# Altium project MB1184.PrjPCB
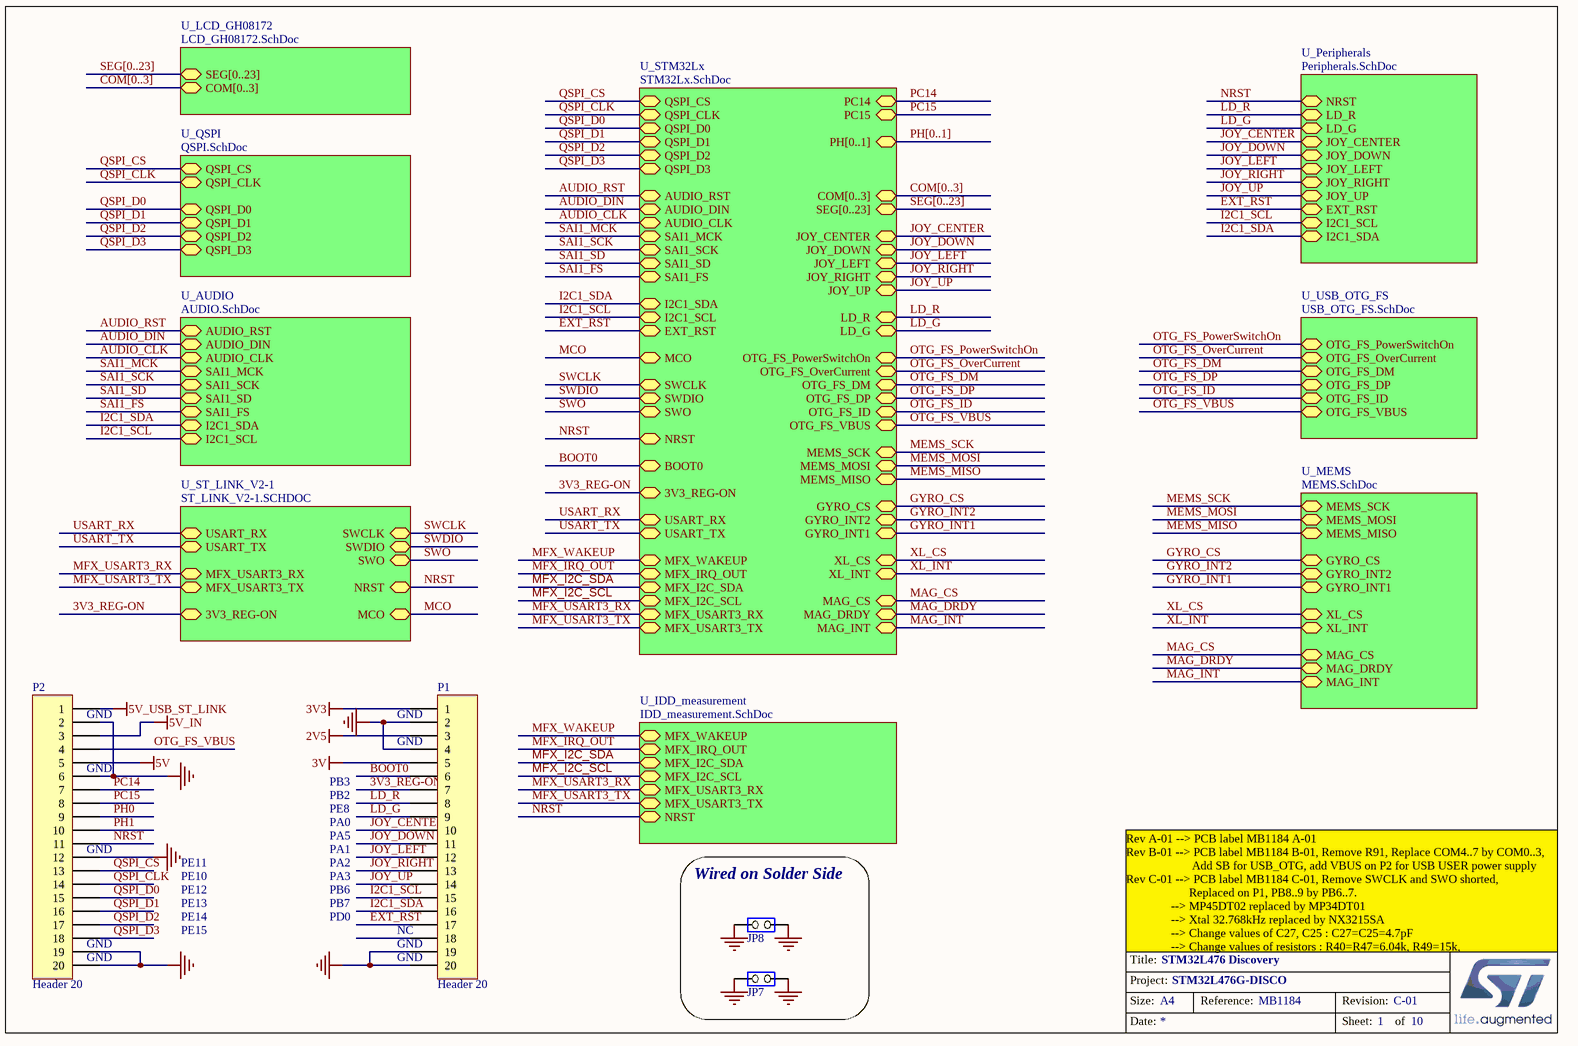
[diagram p0: MB1184.SchDoc]
5 sheets, 147 parts. Net scope: hierarchical (ports join the sheet entries above them; power ports are global).
Sheets:
  MB1184.SchDoc
    U_ST_LINK_V2-1 = ST_LINK_V2-1.SCHDOC
    U_USB_OTG_FS = USB_OTG_FS.SchDoc
    U_Peripherals = Peripherals.SchDoc
    U_QSPI = QSPI.SchDoc

## Sheet MB1184.SchDoc: STM32L476 Discovery
size A4; Date: 01-DEC-2013; Author: A.B; CompanyName: STMicroelectronics; Organization: Microcontrollers Division; Address1: 12, Rue Jules HOROWITZ; Address2: 38019 Grenoble; Address3: FRANCE; DocumentNumber: MB1184; Revision: C-01; SheetNumber: 1; SheetTotal: 10; Project: STM32L476G-DISCO

### Parts
JP7  Jumper 2 pins  [SIP2/2.54]  (value not drawn)
JP8  Jumper 2 pins  [SIP2/2.54]  (value not drawn)
P1  Header 20  [HDR1X20]
P2  Header 20  [HDR1X20]

### Blocks framed on the sheet
Wired on Solder Side: JP7 JP8

### Sub-sheets
U_AUDIO = AUDIO.SchDoc (file not in this document): AUDIO_CLK, AUDIO_DIN, AUDIO_RST, SAI1_FS, SAI1_SD, SAI1_SCK, I2C1_SCL, I2C1_SDA, SAI1_MCK
U_IDD_measurement = IDD_measurement.SchDoc (file not in this document): MFX_WAKEUP, MFX_IRQ_OUT, MFX_I2C_SDA, MFX_I2C_SCL, MFX_USART3_RX, MFX_USART3_TX, NRST
U_LCD_GH08172 = LCD_GH08172.SchDoc (file not in this document): SEG[0..23], COM[0..3]
U_MEMS = MEMS.SchDoc (file not in this document): GYRO_CS, MAG_CS, MAG_INT, XL_INT, MAG_DRDY, MEMS_SCK, MEMS_MISO, MEMS_MOSI, GYRO_INT1, GYRO_INT2, XL_CS
U_Peripherals = Peripherals.SchDoc: NRST, LD_R, LD_G, EXT_RST, JOY_CENTER, JOY_DOWN, JOY_LEFT, JOY_RIGHT, JOY_UP, I2C1_SCL, I2C1_SDA
U_QSPI = QSPI.SchDoc: QSPI_D0, QSPI_D3, QSPI_D2 (bidir), QSPI_D1, QSPI_CLK, QSPI_CS
U_ST_LINK_V2-1 = ST_LINK_V2-1.SCHDOC: SWDIO, SWCLK, MCO, NRST, USART_RX, USART_TX, MFX_USART3_RX, MFX_USART3_TX, SWO, 3V3_REG-ON
U_STM32Lx = STM32Lx.SchDoc (file not in this document): NRST, MCO, LD_R, SWCLK, SWDIO, USART_TX, USART_RX, LD_G, MFX_IRQ_OUT, MFX_WAKEUP, QSPI_D0, QSPI_D3, QSPI_D2 (bidir), QSPI_D1, QSPI_CLK, QSPI_CS, SAI1_FS, SAI1_SD, SAI1_SCK, I2C1_SCL, I2C1_SDA, AUDIO_RST, SAI1_MCK, AUDIO_DIN, AUDIO_CLK, OTG_FS_PowerSwitchOn, OTG_FS_DM, OTG_FS_DP, OTG_FS_ID, OTG_FS_VBUS, OTG_FS_OverCurrent, SEG[0..23], COM[0..3], EXT_RST, PH[0..1], JOY_CENTER, JOY_DOWN, JOY_LEFT, JOY_RIGHT, JOY_UP, MEMS_SCK, MEMS_MISO, MEMS_MOSI, GYRO_CS, GYRO_INT1, GYRO_INT2, XL_CS, XL_INT, MAG_CS, MAG_DRDY, MAG_INT, MFX_USART3_RX, MFX_USART3_TX, MFX_I2C_SDA, MFX_I2C_SCL, BOOT0, SWO, 3V3_REG-ON, PC14, PC15
U_USB_OTG_FS = USB_OTG_FS.SchDoc: OTG_FS_PowerSwitchOn, OTG_FS_OverCurrent, OTG_FS_DM, OTG_FS_DP, OTG_FS_ID, OTG_FS_VBUS

### Nets
2V5: P1.3
3V: P1.5
3V3: P1.1
5V: P2.5
5V_IN: P2.3
5V_USB_ST_LINK: P2.1
GND: JP7.1(COMMON) JP7.2(NO) JP8.1(COMMON) JP8.2(NO) P1.2 P1.4 P1.19 P1.20 P2.2 P2.6 P2.12 P2.19 P2.20
3V3_REG-ON: P1.7 ; sheet U_STM32Lx/3V3_REG-ON, sheet U_ST_LINK_V2-1/3V3_REG-ON
AUDIO_CLK: sheet U_STM32Lx/AUDIO_CLK, sheet U_AUDIO/AUDIO_CLK
AUDIO_DIN: sheet U_STM32Lx/AUDIO_DIN, sheet U_AUDIO/AUDIO_DIN
AUDIO_RST: sheet U_STM32Lx/AUDIO_RST, sheet U_AUDIO/AUDIO_RST
BOOT0: P1.6 ; sheet U_STM32Lx/BOOT0
EXT_RST: P1.17 ; sheet U_STM32Lx/EXT_RST, sheet U_Peripherals/EXT_RST
GYRO_CS: sheet U_STM32Lx/GYRO_CS, sheet U_MEMS/GYRO_CS
GYRO_INT1: sheet U_STM32Lx/GYRO_INT1, sheet U_MEMS/GYRO_INT1
GYRO_INT2: sheet U_STM32Lx/GYRO_INT2, sheet U_MEMS/GYRO_INT2
I2C1_SCL: P1.15 ; sheet U_STM32Lx/I2C1_SCL, sheet U_AUDIO/I2C1_SCL, sheet U_Peripherals/I2C1_SCL
I2C1_SDA: P1.16 ; sheet U_STM32Lx/I2C1_SDA, sheet U_AUDIO/I2C1_SDA, sheet U_Peripherals/I2C1_SDA
JOY_CENTER: P1.10 ; sheet U_STM32Lx/JOY_CENTER, sheet U_Peripherals/JOY_CENTER
JOY_DOWN: P1.11 ; sheet U_STM32Lx/JOY_DOWN, sheet U_Peripherals/JOY_DOWN
JOY_LEFT: P1.12 ; sheet U_STM32Lx/JOY_LEFT, sheet U_Peripherals/JOY_LEFT
JOY_RIGHT: P1.13 ; sheet U_STM32Lx/JOY_RIGHT, sheet U_Peripherals/JOY_RIGHT
JOY_UP: P1.14 ; sheet U_STM32Lx/JOY_UP, sheet U_Peripherals/JOY_UP
LD_G: P1.9 ; sheet U_STM32Lx/LD_G, sheet U_Peripherals/LD_G
LD_R: P1.8 ; sheet U_STM32Lx/LD_R, sheet U_Peripherals/LD_R
MAG_CS: sheet U_STM32Lx/MAG_CS, sheet U_MEMS/MAG_CS
MAG_DRDY: sheet U_STM32Lx/MAG_DRDY, sheet U_MEMS/MAG_DRDY
MAG_INT: sheet U_STM32Lx/MAG_INT, sheet U_MEMS/MAG_INT
MCO: sheet U_STM32Lx/MCO, sheet U_ST_LINK_V2-1/MCO
MEMS_MISO: sheet U_STM32Lx/MEMS_MISO, sheet U_MEMS/MEMS_MISO
MEMS_MOSI: sheet U_STM32Lx/MEMS_MOSI, sheet U_MEMS/MEMS_MOSI
MEMS_SCK: sheet U_STM32Lx/MEMS_SCK, sheet U_MEMS/MEMS_SCK
MFX_I2C_SCL: sheet U_STM32Lx/MFX_I2C_SCL, sheet U_IDD_measurement/MFX_I2C_SCL
MFX_I2C_SDA: sheet U_STM32Lx/MFX_I2C_SDA, sheet U_IDD_measurement/MFX_I2C_SDA
MFX_IRQ_OUT: sheet U_STM32Lx/MFX_IRQ_OUT, sheet U_IDD_measurement/MFX_IRQ_OUT
MFX_USART3_RX: sheet U_STM32Lx/MFX_USART3_RX, sheet U_ST_LINK_V2-1/MFX_USART3_RX, sheet U_IDD_measurement/MFX_USART3_RX
MFX_USART3_TX: sheet U_STM32Lx/MFX_USART3_TX, sheet U_ST_LINK_V2-1/MFX_USART3_TX, sheet U_IDD_measurement/MFX_USART3_TX
MFX_WAKEUP: sheet U_STM32Lx/MFX_WAKEUP, sheet U_IDD_measurement/MFX_WAKEUP
NRST: P2.11 ; sheet U_STM32Lx/NRST, sheet U_ST_LINK_V2-1/NRST, sheet U_IDD_measurement/NRST, sheet U_Peripherals/NRST
OTG_FS_DM: sheet U_STM32Lx/OTG_FS_DM, sheet U_USB_OTG_FS/OTG_FS_DM
OTG_FS_DP: sheet U_STM32Lx/OTG_FS_DP, sheet U_USB_OTG_FS/OTG_FS_DP
OTG_FS_ID: sheet U_STM32Lx/OTG_FS_ID, sheet U_USB_OTG_FS/OTG_FS_ID
OTG_FS_OverCurrent: sheet U_STM32Lx/OTG_FS_OverCurrent, sheet U_USB_OTG_FS/OTG_FS_OverCurrent
OTG_FS_PowerSwitchOn: sheet U_STM32Lx/OTG_FS_PowerSwitchOn, sheet U_USB_OTG_FS/OTG_FS_PowerSwitchOn
OTG_FS_VBUS: P2.4 ; sheet U_STM32Lx/OTG_FS_VBUS, sheet U_USB_OTG_FS/OTG_FS_VBUS
PC14: P2.7 ; sheet U_STM32Lx/PC14
PC15: P2.8 ; sheet U_STM32Lx/PC15
PH0: P2.9
PH1: P2.10
QSPI_CLK: P2.14 ; sheet U_STM32Lx/QSPI_CLK, sheet U_QSPI/QSPI_CLK
QSPI_CS: P2.13 ; sheet U_STM32Lx/QSPI_CS, sheet U_QSPI/QSPI_CS
QSPI_D0: P2.15 ; sheet U_STM32Lx/QSPI_D0, sheet U_QSPI/QSPI_D0
QSPI_D1: P2.16 ; sheet U_STM32Lx/QSPI_D1, sheet U_QSPI/QSPI_D1
QSPI_D2: P2.17 ; sheet U_STM32Lx/QSPI_D2, sheet U_QSPI/QSPI_D2
QSPI_D3: P2.18 ; sheet U_STM32Lx/QSPI_D3, sheet U_QSPI/QSPI_D3
SAI1_FS: sheet U_STM32Lx/SAI1_FS, sheet U_AUDIO/SAI1_FS
SAI1_MCK: sheet U_STM32Lx/SAI1_MCK, sheet U_AUDIO/SAI1_MCK
SAI1_SCK: sheet U_STM32Lx/SAI1_SCK, sheet U_AUDIO/SAI1_SCK
SAI1_SD: sheet U_STM32Lx/SAI1_SD, sheet U_AUDIO/SAI1_SD
SWCLK: sheet U_STM32Lx/SWCLK, sheet U_ST_LINK_V2-1/SWCLK
SWDIO: sheet U_STM32Lx/SWDIO, sheet U_ST_LINK_V2-1/SWDIO
SWO: sheet U_STM32Lx/SWO, sheet U_ST_LINK_V2-1/SWO
USART_RX: sheet U_STM32Lx/USART_RX, sheet U_ST_LINK_V2-1/USART_RX
USART_TX: sheet U_STM32Lx/USART_TX, sheet U_ST_LINK_V2-1/USART_TX
XL_CS: sheet U_STM32Lx/XL_CS, sheet U_MEMS/XL_CS
XL_INT: sheet U_STM32Lx/XL_INT, sheet U_MEMS/XL_INT

Not connected (* = marked no-connect by the designer): P1 18

### Buses and harness runs
bus COM[0..3] = sheet U_LCD_GH08172/COM[0..3]
bus COM[0..3] = sheet U_STM32Lx/COM[0..3]
bus PH[0..1] = sheet U_STM32Lx/PH[0..1]
bus SEG[0..23] = sheet U_LCD_GH08172/SEG[0..23]
bus SEG[0..23] = sheet U_STM32Lx/SEG[0..23]

### Notes on the sheet
- (near P2) GND
- (near P1) GND
- PB3
- PB2
- PE8
- PA0
- PA5
- PA1
- PE11
- PE10
- PE12
- PE13
- PE14
- PA2
- PA3
- PB6
- PB7
- PD0
- PE15
- (near P1) NC
- Rev A-01 --> PCB label MB1184 A-01
  Rev B-01 --> PCB label MB1184 B-01, Remove R91, Replace COM4..7 by COM0..3,
  Add SB for USB_OTG, add VBUS on P2 for USB USER power supply
  Rev C-01 --> PCB label MB1184 C-01, Remove SWCLK and SWO shorted,
  Replaced on P1, PB8..9 by PB6..7.
  --> MP45DT02 replaced by MP34DT01
  --> Xtal 32.768kHz replaced by NX3215SA
  --> Change values of C27, C25 : C27=C25=4.7pF
  --> Change values of resistors : R40=R47=6.04k, R49=15k, R48=R42=R50=300k
- Title:
- Project:
- Size:
- Date:
- A4
- Reference:
- Sheet:
- Revision:
- of

### Library data of the parts
JP7 JP8 = Jumper2: ECCN_US/EU: n/a
P1 P2 = Header 20: Header, 20-Pin; LatestRevisionDate: 17-Jul-2002; LatestRevisionNote: Re-released for DXP Platform.; Publisher: Altium Limited

## Sheet ST_LINK_V2-1.SCHDOC: ST-LINK/V2-1 with support of SWD only
size A4; Date: 01-DEC-2013; Author: A.B; CompanyName: STMicroelectronics; Organization: Microcontrollers Division; Address1: 12, Rue Jules HOROWITZ; Address2: 38019 Grenoble; Address3: FRANCE; DocumentNumber: MB1184; Revision: C-01; SheetNumber: 2; SheetTotal: 10; Project: STM32L476G-DISCO
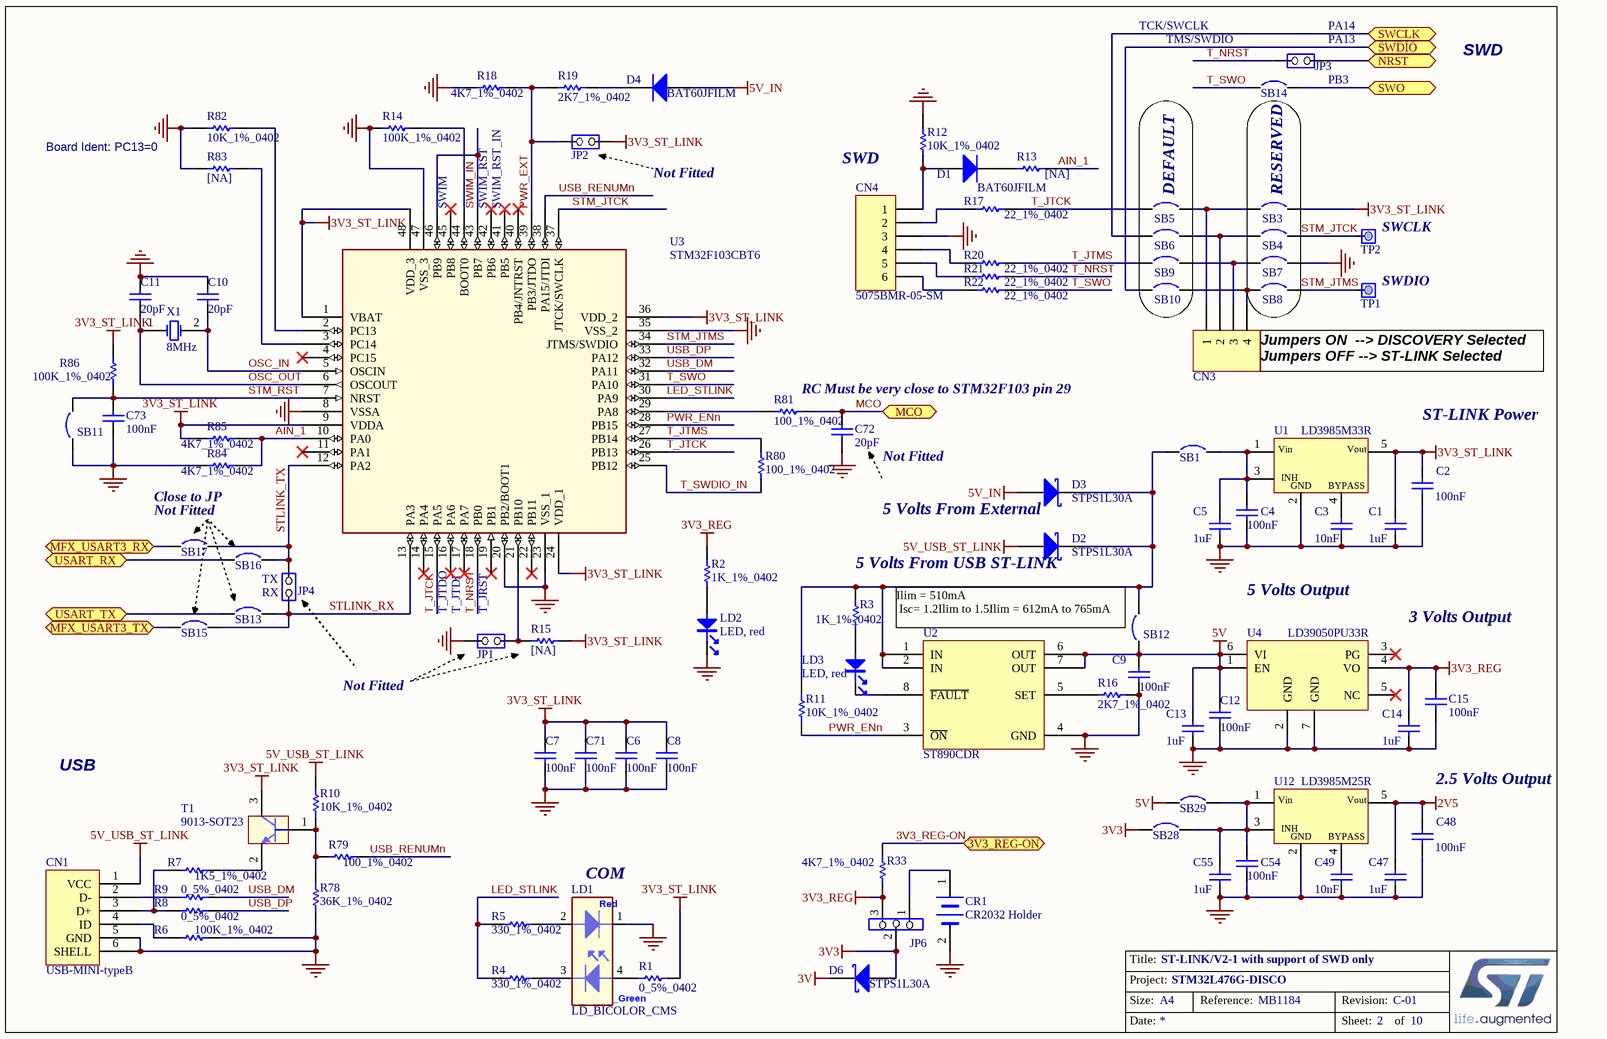
[diagram p1: ST_LINK_V2-1.SCHDOC]

### Parts
C1  1uF  [0603C]
C2  100nF  [0402C]
C3  10nF  [0603C]
C4  100nF  [0402C]
C5  1uF  [0603C]
C6  100nF  [0402C]
C7  100nF  [0402C]
C8  100nF  [0402C]
C9  100nF  [0402C]
C10  20pF  [0402C]
C11  20pF  [0402C]
C12  100nF  [0402C]
C13  1uF  [0603C]
C14  1uF  [0603C]
C15  100nF  [0402C]
C47  1uF  [0603C]
C48  100nF  [0402C]
C49  10nF  [0603C]
C54  100nF  [0402C]
C55  1uF  [0603C]
C71  100nF  [0402C]
C72  20pF  [0402C]
C73  100nF  [0402C]
CN1  USB-MINI-typeB  [USB-MINI-B-SMD]
CN3  Header 4  [Header 4]  (value not drawn)
CN4  5075BMR-05-SM  [HDR1X6]
CR1  CR2032 Holder  [CR2032/SMT]
D1  BAT60JFILM  [SOD323/A]
D2  STPS1L30A  [SMA]
D3  STPS1L30A  [SMA]
D4  BAT60JFILM  [SOD323/A]
D6  STPS1L30A  [SMA]
JP1  Jumper 2 pins  [SIP2/2.54]  (value not drawn)
JP2  Jumper 2 pins  [SIP2/2.54]  (value not drawn)
JP3  Jumper 2 pins  [SIP2/2.54]  (value not drawn)
JP4  Jumper 2 pins  [SIP2/2.54]  (value not drawn)
JP6  Jumper 3 pins  [SIP3]  (value not drawn)
LD1  LD_BICOLOR_CMS  [HSMF-A201]
LD2  LED, red  [0603D]
LD3  LED, red  [0603D]
R1  0_5%_0402  [0402R]
R2  1K_1%_0402  [0402R]
R3  1K_1%_0402  [0402R]
R4  330_1%_0402  [0402R]
R5  330_1%_0402  [0402R]
R6  100K_1%_0402  [0402R]
R7  1K5_1%_0402  [0402R]
R8  0_5%_0402  [0402R]
R9  0_5%_0402  [0402R]
R10  10K_1%_0402  [0402R]
R11  10K_1%_0402  [0402R]
R12  10K_1%_0402  [0402R]
R13  [NA]  [0402R]
R14  100K_1%_0402  [0402R]
R15  [NA]  [0402R]
R16  2K7_1%_0402  [0402R]
R17  22_1%_0402  [0402R]
R18  4K7_1%_0402  [0402R]
R19  2K7_1%_0402  [0402R]
R20  22_1%_0402  [0402R]
R21  22_1%_0402  [0402R]
R22  22_1%_0402  [0402R]
R33  4K7_1%_0402  [0402R]
R78  36K_1%_0402  [0402R]
R79  100_1%_0402  [0402R]
R80  100_1%_0402  [0402R]
R81  100_1%_0402  [0402R]
R82  10K_1%_0402  [0402R]
R83  [NA]  [0402R]
R84  4K7_1%_0402  [0402R]
R85  4K7_1%_0402  [0402R]
R86  100K_1%_0402  [0402R]
SB1  Circuit Breaker  [JP2_SMD]  (value not drawn)
SB3  Circuit Breaker  [JP2_SMD]  (value not drawn)
SB4  Circuit Breaker  [JP2_SMD]  (value not drawn)
SB5  Circuit Breaker  [JP2_SMD]  (value not drawn)
SB6  Circuit Breaker  [JP2_SMD]  (value not drawn)
SB7  Circuit Breaker  [JP2_SMD]  (value not drawn)
SB8  Circuit Breaker  [JP2_SMD]  (value not drawn)
SB9  Circuit Breaker  [JP2_SMD]  (value not drawn)
SB10  Circuit Breaker  [JP2_SMD]  (value not drawn)
SB11  Circuit Breaker  [JP2_SMD]  (value not drawn)
SB12  Circuit Breaker  [JP2_SMD]  (value not drawn)
SB13  Circuit Breaker  [JP2_SMD]  (value not drawn)
SB14  Circuit Breaker  [JP2_SMD]  (value not drawn)
SB15  Circuit Breaker  [JP2_SMD]  (value not drawn)
SB16  Circuit Breaker  [JP2_SMD]  (value not drawn)
SB17  Circuit Breaker  [JP2_SMD]  (value not drawn)
SB28  Circuit Breaker  [JP2_SMD]  (value not drawn)
SB29  Circuit Breaker  [JP2_SMD]  (value not drawn)
T1  9013-SOT23  [SOT23]
TP1  Test point 1 pin with hole  [SIP1/2.54]  (value not drawn)
TP2  Test point 1 pin with hole  [SIP1/2.54]  (value not drawn)
U1  LD3985M33R  [SOT-23-5L]
U2  ST890CDR  [SO-8]
U3  STM32F103CBT6  [QFP48 7x7]
U4  LD39050PU33R  [DFN6_3x3]
U12  LD3985M25R  [SOT-23-5L]
X1  8MHz  [XTAL1]

### Blocks framed on the sheet
DEFAULT: SB5 SB6 SB9 SB10
RESERVED: SB3 SB4 SB7 SB8

### Ports
3V3_REG-ON, MCO, MFX_USART3_RX, MFX_USART3_TX, NRST, SWCLK, SWDIO, SWO, USART_RX, USART_TX

### Nets
2V5: C47.1 C48.2 U12.5(Vout)
3V: D6.2(K)
3V3: D6.1(A) JP6.2 SB28.1
3V3_REG: C14.2 C15.2 JP6.3 R2.2 R33.1 U4.4(VO)
3V3_ST_LINK: C1.1 C2.2 C6.1 C7.2 C8.2 C71.2 JP2.2(NO) R1.2 R15.2 R85.1 R86.2 SB3.2 T1.3(C) U1.5(Vout) U3.1(VBAT) U3.9(VDDA) U3.24(VDD_1) U3.36(VDD_2) U3.48(VDD_3)
5V: C9.2 C12.2 C13.2 SB12.1 SB29.1 U2.6(OUT) U2.7(OUT) U4.1(EN) U4.6(VI)
5V_IN: D3.1(A) D4.1(A)
5V_USB_ST_LINK: CN1.1(VCC) D2.1(A) R10.2
GND: C1.2 C2.1 C3.1 C4.1 C5.1 C6.2 C7.1 C8.1 C9.1 C10.1 C11.1 C12.1 C13.1 C14.1 C15.1 C47.2 C48.1 C49.1 C54.1 C55.1 C71.1 C72.2 C73.1 CN1.5(GND) CN1.6(SHELL) CN4.3 CR1.2(-) JP1.1(COMMON) LD1.1 LD2.2 R6.2 R12.2 R14.1 R16.2 R18.1 R78.1 R82.1 R83.1 R84.1 SB7.2 SB11.1 U1.2(GND) U2.4(GND) U3.8(VSSA) U3.20(PB2/BOOT1) U3.23(VSS_1) U3.35(VSS_2) U3.47(VSS_3) U4.2(GND) U4.7(GND) U12.2(GND)
3V3_REG-ON: R33.2 ; port 3V3_REG-ON
AIN_1: R13.2 R84.2 R85.2 U3.10(PA0)
LED_STLINK: R4.1 R5.1 U3.30(PA9)
MCO: C72.1 R81.2 ; port MCO
MFX_USART3_RX: SB17.1 ; port MFX_USART3_RX
MFX_USART3_TX: SB15.1 ; port MFX_USART3_TX
NRST: JP3.2(NO) ; port NRST
OSC_IN: C10.2 U3.5(OSCIN) X1.2(OSC2)
OSC_OUT: C11.2 U3.6(OSCOUT) X1.1(OSC1)
PWR_ENn: R11.1 U2.3(~{ON}) U3.28(PB15)
PWR_EXT: JP2.1(COMMON) R18.2 R19.1 U3.39(PB3/JTDO)
STLINK_RX: JP4.1(COMMON) SB13.2 SB15.2 U3.13(PA3)
STLINK_TX: JP4.2(NO) SB16.2 SB17.2 U3.12(PA2)
STM_JTCK: SB4.2 TP2.1(COMMON) U3.37(JTCK/SWCLK)
STM_JTMS: SB8.2 TP1.1(COMMON) U3.34(JTMS/SWDIO)
STM_RST: C73.2 R86.1 SB11.2 U3.7(NRST)
SWCLK: SB6.1 ; port SWCLK
SWDIO: SB10.1 ; port SWDIO
SWIM_IN: U3.43(PB7) U3.46(PB9)
SWO: SB14.2 ; port SWO
T_JTCK: R17.2 SB5.1 U3.15(PA5) U3.26(PB13)
T_JTMS: R20.2 R80.2 SB9.1 U3.27(PB14)
T_NRST: JP3.1(COMMON) R21.2 U3.18(PB0)
T_SWDIO_IN: R80.1 U3.25(PB12)
T_SWO: R22.2 SB14.1 U3.31(PA10)
USART_RX: SB16.1 ; port USART_RX
USART_TX: SB13.1 ; port USART_TX
USB_DM: R9.2 U3.32(PA11)
USB_DP: R8.2 U3.33(PA12)
USB_RENUMn: R79.2 U3.38(PA15/JTDI)
NetC3_2: C3.2 U1.4(BYPASS)
NetC4_2: C4.2 C5.2 SB1.2 U1.1(Vin) U1.3(CE)
NetC49_2: C49.2 U12.4(BYPASS)
NetC54_2: C54.2 C55.2 SB28.2 SB29.2 U12.1(Vin) U12.3(CE)
NetCN1_2: CN1.2(D-) R9.1
NetCN1_3: CN1.3(D+) R7.1 R8.1
NetCN1_4: CN1.4(ID) R6.1
NetCN3_1: CN3.1 SB3.1 SB5.2
NetCN3_2: CN3.2 SB4.1 SB6.2
NetCN3_3: CN3.3 SB7.1 SB9.2
NetCN3_4: CN3.4 SB8.1 SB10.2
NetCN4_1: CN4.1 D1.1(A) R12.1
NetCN4_2: CN4.2 R17.1
NetCN4_4: CN4.4 R20.1
NetCN4_5: CN4.5 R21.1
NetCN4_6: CN4.6 R22.1
NetCR1_1: CR1.1(+) JP6.1
NetD1_2: D1.2(K) R13.1
NetD2_2: D2.2(K) D3.2(K) R3.2 R11.2 SB1.1 SB12.2 U2.1(IN) U2.2(IN)
NetD4_2: D4.2(K) R19.2
NetJP1_2: JP1.2(NO) R15.1 U3.21(PB10)
NetLD1_2: LD1.2 R5.2
NetLD1_3: LD1.3 R4.2
NetLD1_4: LD1.4 R1.1
NetLD2_1: LD2.1 R2.1
NetLD3_1: LD3.1 R3.1
NetLD3_2: LD3.2 U2.8(~{FAULT})
NetR7_2: R7.2 T1.2(E)
NetR10_1: R10.1 R78.2 R79.1 T1.1(B)
NetR14_2: R14.2 U3.44(BOOT0)
NetR16_1: R16.1 U2.5(SET)
NetR81_1: R81.1 U3.29(PA8)
NetR82_2: R82.2 U3.2(PC13)
NetR83_2: R83.2 U3.3(PC14)

Not connected (* = marked no-connect by the designer): U3 4(PC15)* 11(PA1)* 14(PA4)* 16(PA6)* 17(PA7)* 19(PB1)* 22(PB11)* 40(PB4/JNTRST)* 41(PB5)* 42(PB6)* 45(PB8)*; U4 3(PG)* 5(NC)*

### Notes on the sheet
- TCK/SWCLK
- TMS/SWDIO
- (near JP3) PA14
- (near JP3) PA13
- PB3
- SWD
- Board Ident: PC13=0
- Not Fitted
- SWIM
- (near U3) SWIM_RST
- SWIM_RST_IN
- (near TP2) SWCLK
- (near TP1) SWDIO
- (near CN3) Jumpers ON  --> DISCOVERY Selected
  Jumpers OFF --> ST-LINK Selected
- (near R81) RC Must be very close to STM32F103 pin 29
- ST-LINK Power
- Close to JP
- (near C72) Not Fitted
- (near D3) 5 Volts From External
- TX
- (near D2) 5 Volts From USB ST-LINK
- RX
- T_JTDO
- T_JTDI
- T_JRST
- (near SB12) Ilim = 510mA
  Isc= 1.2Ilim to 1.5Ilim = 612mA to 765mA
- 5 Volts Output
- 3 Volts Output
- USB
- 2.5 Volts Output
- (near LD1) COM
- Title:
- Project:
- Size:
- Date:
- A4
- Reference:
- Sheet:
- Revision:
- of
- (in symbol LD3985M25R) INH
- (in symbol LD3985M33R) INH
- (in symbol LD_BICOLOR_CMS) Red; _Green

### Library data of the parts
C1 C5 C13 C14 C47 C55 = Cap_1uF_X5R_10%_0603: Capacitor,1uF,16V,X5R,10%,0603,YAGEO; Manuf_Part_1: CC0603KRX5R7BB105; Revision: July-2002: Re-released for DXP Platform.; Value: 1uF; Order: CC0603KRX5R7BB105; Manuf_1: YAGEO
C2 C4 C6-C9 C12 C15 C48 C54 C71 C73 = Cap_100nF_X7R_10%_0402: Capacitor,100nF,16V,X7R,10%,0402,YAGEO; Manuf_Part_1: CC0402KRX7R7BB104; Revision: July-2002: Re-released for DXP Platform.; Value: 100nF; Order: CC0402KRX7R7BB104; Manuf_1: YAGEO
C3 C49 = Cap_10nF_X7R_10%_0603: Capacitor,10nF,50V,X7R,10%,0603,YAGEO; Manuf_Part_1: CC0603KRX7R9BB103; Revision: July-2002: Re-released for DXP Platform.; Value: 10nF; Order: CC0603KRX7R9BB103; Manuf_1: YAGEO
C10 C11 = Cap_20pF_NPO_5%_0402: Capacitor,20pF,50V,NPO,5%,0402,YAGEO; Order: CC0402JRNPO9BN200; Revision: July-2002: Re-released for DXP Platform.; Value: 20pF; Manuf_1: YAGEO; Manuf_Part_1: CC0402JRNPO9BN200
C72 = Cap_20pF_NPO_5%_0402: Capacitor,20pF,50V,NPO,5%,0402,YAGEO; Order: CC0402JRNPO9BN200; Fitted: NO; Revision: July-2002: Re-released for DXP Platform.; Value: 20pF; Manuf_1: YAGEO; Manuf_Part_1: CC0402JRNPO9BN200
CN1 = USB-MINI-typeB connector: Manuf_Part_1: 5075BMR-05-SM; Manuf_Part_2: 218205M1110T; Manuf_2: lyconn; Order: 5075BMR-05-SM; ECCN_US/EU: n/a
CN3 = Header 4: Header, 4-Pin; Revision: 17-Jul-2002: Re-released for DXP Platform.; Publisher: Altium Limited; ECCN_US/EU: n/a
CN4 = Header 6: Header, 6-Pin; LatestRevisionDate: 17-Jul-2002; LatestRevisionNote: Re-released for DXP Platform.; Publisher: Altium Limited; ECCN_US/EU: n/a
CR1 = BATT_2032: CR2032 socket, S8421-45R; Manuf_2: Lotes; Manuf_Part_2: KB7410AP2L; Manuf_1: HARWIN; Order: 952-1737-2-ND; ECCN_US/EU: EAR99/NEC; Distrib_2: http://www.bestbattery.co.kr/lotes/lotes.htm; Manuf_Part_1: S8421-45R; Distrib: DIGIKEY
D1 D4 = BAT60JFILM: Manuf_1: STM; Provided: ST; ECCN_US/EU: EAR99/NEC; Ref St: 9151097; Revision: July-2002: Re-released for DXP Platform.; Order: BAT60JFILM; Manuf_Part_1: BAT60JFILM; Distrib: ST
D2 D3 D6 = STPS1L30A: Low Drop power Schottky rectifier; Manuf_1: STM; Provided: ST; Ref St: xxxxxxxx; ECCN_US/EU: EAR99/NEC; Manuf_Part_1: STPS1L30A; Order: STPS1L30A; Distrib: ST
JP1 JP2 JP4 = Jumper2: Fitted: NO; ECCN_US/EU: n/a
JP3 = Jumper2: ECCN_US/EU: n/a
JP6 = Jumper3: ECCN_US/EU: n/a
LD1 = LD_BICOLOR_CMS: Bicolor Led; Manuf_Part_1: HSMF-A201-A00J1; Manuf_1: Avago Technologies; Manuf_2: everluck; Manuf_Part_2: LE-RGW35280; Ref St: xxxxxx; ECCN_US/EU: EAR99/NEC; Distrib: RADIOSPARES
LD2 LD3 = LED_red: LED, red, 0603; Manuf_1: everlight; Manuf_Part_1: 19-213-R6C-AP1Q2B/3T; ECCN_US/EU: EAR99/NEC; Order: 19-213-R6C-AP1Q2B/3T
R1 R8 R9 = Res_0_5%_0402: Resistor,0,0402,5%,YAGEO; Manuf_Part_1: RC0402JR-070RL; Value: 0; Order: 2363467; ECCN_US/EU: n/a; Manuf_1: YAGEO; Distrib: FARNELL
R2 R3 = Res_1K_1%_0402: Resistor,1K,0402,1%,YAGEO; Manuf_Part_1: RC0402FR-071KL; Value: 1K; Manuf_1: YAGEO; Order: RC0402FR-071KL; ECCN_US/EU: n/a
R4 R5 = Res_330_1%_0402: Resistor,330,0402,1%,YAGEO; Manuf_Part_1: RC0402FR-07330RL; Value: 330; ECCN_US/EU: n/a; Manuf_1: YAGEO; Distrib: DIGIKEY; Order: RC0402FR-07330RL
R6 R14 R86 = Res_100K_1%_0402: Resistor,100K,0402,1%,YAGEO; Manuf_Part_1: RT0402FRE07100KL; Value: 100K; Manuf_1: YAGEO; Order: RT0402FRE07100KL; ECCN_US/EU: n/a
R7 = Res_1K5_1%_0402: Resistor,1K5,0402,1%,YAGEO; Manuf_Part_1: RC0402FR-071K5L; Value: 1K5; Manuf_1: YAGEO; Order: RC0402FR-071K5L; ECCN_US/EU: n/a; Distrib: FARNELL
R10-R12 R82 = Res_10K_1%_0402: Resistor,10K,0402,1%,YAGEO; Manuf_Part_1: RC0402FR-0710KL; Value: 10K; Manuf_1: YAGEO; Order: RC0402FR-0710KL; ECCN_US/EU: n/a
R13 R15 R83 = Res_NA_0402: Resistor,[NA],0402; Fitted: NO; Value: [NA]; ECCN_US/EU: n/a
R16 R19 = Res_2K7_1%_0402: Resistor,2K7,0402,1%,YAGEO; Manuf_Part_1: RC0402FR-072K7L; Value: 2K7; Manuf_1: YAGEO; Order: RC0402FR-072K7L; ECCN_US/EU: n/a; Distrib: FARNELL
R17 R20-R22 = Res_22_1%_0402: Resistor,22,0402,1%,YAGEO; Manuf_Part_1: RC0402FR-0722RL; Value: 22; Manuf_1: YAGEO; Order: RC0402FR-0722RL; ECCN_US/EU: n/a; Distrib: FARNELL
R18 R33 R84 R85 = Res_4K7_1%_0402: Resistor,4K7,0402,1%,YAGEO; Manuf_Part_1: RT0402FRE074K7L; Value: 4K7; Manuf_1: YAGEO; Order: RT0402FRE074K7L; ECCN_US/EU: n/a
R78 = Res_36K_1%_0402: Resistor,36K,0402,1%,YAGEO; Manuf_Part_1: RC0402FR-0736KL; Value: 36K; Manuf_1: YAGEO; Order: RC0402FR-0736KL; ECCN_US/EU: n/a; Distrib: FARNELL
R79-R81 = Res_100_1%_0402: Resistor,100,0402,1%,YAGEO; Manuf_Part_1: RC0402FR-07100RL; Value: 100; Order: 9239111; Manuf_1: YAGEO; ECCN_US/EU: n/a; Distrib: FARNELL
SB1 SB5 SB6 SB9 SB10 SB13 SB16 SB28 = Circuit Breaker: Solder: YES; Revision: July-2002: Re-released for DXP Platform.
SB3 SB4 SB7 SB8 SB11 SB12 SB14 SB15 SB17 SB29 = Circuit Breaker: Solder: NO; Revision: July-2002: Re-released for DXP Platform.
T1 = 9013-SOT23: NPN Bipolar Transistor; Manuf_1: NXP; Manuf_Part_1: BSR14; Order: 1081310; ECCN_US/EU: EAR99/NEC; Revision: July-2002: Re-released for DXP Platform.; Distrib: FARNELL
TP1 TP2 = TP1: Test Point; Fitted: NO; ECCN_US/EU: n/a
U1 = LD3985M33R: Ultra low drop-low noise BiCMOS voltage, regulators low ESR capacitors compatible; Manuf_1: STM; Provided: ST; Ref St: 9176161; ECCN_US/EU: EAR99/NEC; Manuf_Part_1: LD3985M33R; Distrib: ST; Order: LD3985M33R
U2 = ST890CDR: 1.2 A current limited high-side power switch with thermal shutdown; Manuf_1: STM; ECCN_US/EU: EAR99/NEC; Provided: ST; Manuf_Part_1: ST890CDR; Distrib: ST
U3 = STM32F103CBT6: Medium-density performance line ARM-based 32-bit MCU with 128KB Flash; Manuf_1: STM; Ref St: xxxxxxxx; Provided: ST; ECCN_US/EU: 3A991A2/NEC; Footprint: QFP48 7X7; Manuf_Part_1: STM32F103CBT6; Order: STM32F103CBT6; Distrib: ST
U4 = LD39050P: Ultra low drop-low , 500 mA low quiescent current; Manuf_1: STM; Provided: ST; ECCN_US/EU: EAR99/NEC; Ref St: xxxxxxxx; Distrib: ST; Manuf_Part_1: LD39050PU33R; Order: LD39050PU33R
U12 = LD3985M25R: Ultra low drop-low noise BiCMOS voltage, regulators low ESR capacitors compatible; Manuf_1: STM; Provided: ST; Ref St: 9176007; ECCN_US/EU: EAR99/NEC; Manuf_Part_1: LD3985M25R; Order: LD3985M25R; Distrib: ST
X1 = XTAL_8MHZ_20PPM: Crystal Oscillator,8Mhz,20PF,20PPM,-10-70 degree,DIP,HC-49S; Manuf_Part_1: HC-49S-C20QSA-8.000MHZ; ECCN_US/EU: EAR99/NEC; Order: HC-49S-C20QSA-8.000MHZ

## Sheet USB_OTG_FS.SchDoc: OTG USB FS
size A4; Date: 01-DEC-2013; Author: A.B; CompanyName: STMicroelectronics; Organization: Microcontrollers Division; Address1: 12, Rue Jules HOROWITZ; Address2: 38019 Grenoble; Address3: FRANCE; DocumentNumber: MB1184; Revision: C-01; SheetNumber: 7; SheetTotal: 10; Project: STM32L476G-DISCO
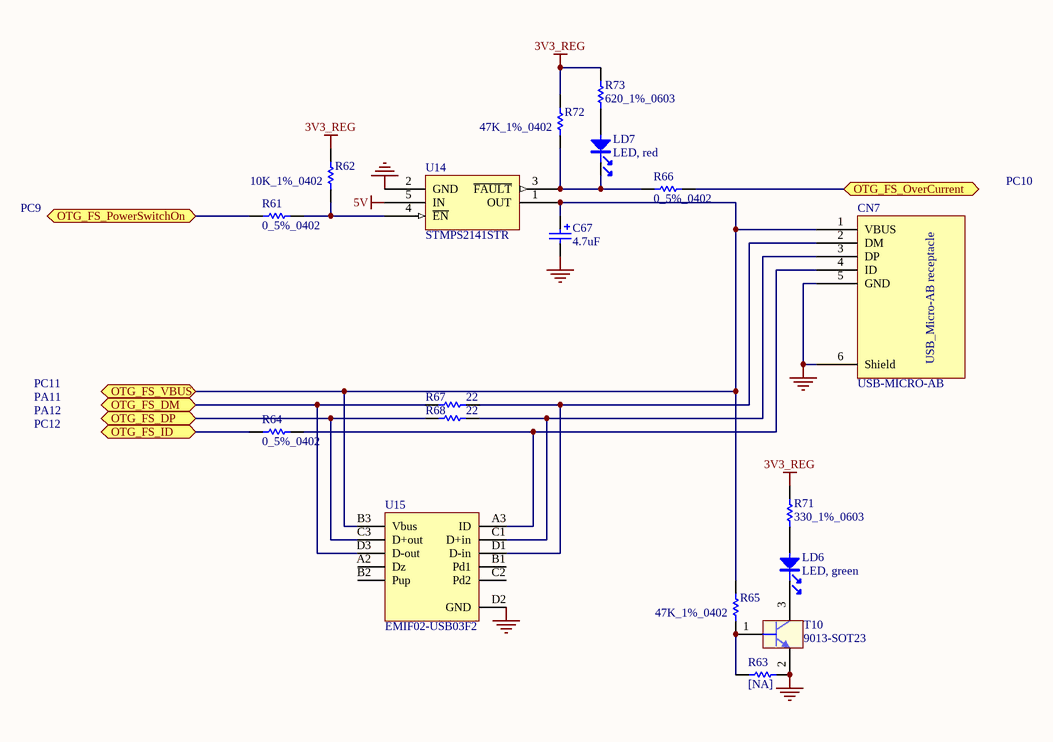
[diagram p2: USB_OTG_FS.SchDoc]

### Parts
C67  4.7uF  [TAN-A]
CN7  USB-MICRO-AB  [USB-MICRO-AB]
LD6  LED, green  [0603D]
LD7  LED, red  [0603D]
R61  0_5%_0402  [0402R]
R62  10K_1%_0402  [0402R]
R63  [NA]  [0402R]
R64  0_5%_0402  [0402R]
R65  47K_1%_0402  [0402R]
R66  0_5%_0402  [0402R]
R67  22  [0402R]
R68  22  [0402R]
R71  330_1%_0603  [0603R]
R72  47K_1%_0402  [0402R]
R73  620_1%_0603  [0603R]
T10  9013-SOT23  [SOT23]
U14  STMPS2141STR  [SOT23-5L]
U15  EMIF02-USB03F2  [Flip Chip]

### Ports
OTG_FS_DM, OTG_FS_DP, OTG_FS_ID, OTG_FS_OverCurrent, OTG_FS_PowerSwitchOn, OTG_FS_VBUS

### Nets
3V3_REG: R62.2 R71.2 R72.2 R73.2
5V: U14.5(IN)
GND: C67.2 CN7.5(GND) CN7.6(Shield) R63.2 T10.2(E) U14.2(GND) U15.D2(GND)
OTG_FS_DM: R67.2 U15.D3(D-out) ; port OTG_FS_DM
OTG_FS_DP: R68.2 U15.C3(D+out) ; port OTG_FS_DP
OTG_FS_ID: R64.1 ; port OTG_FS_ID
OTG_FS_OverCurrent: R66.2 ; port OTG_FS_OverCurrent
OTG_FS_PowerSwitchOn: R61.1 ; port OTG_FS_PowerSwitchOn
OTG_FS_VBUS: C67.1 CN7.1(VBUS) R65.2 U14.1(OUT) U15.B3(Vbus) ; port OTG_FS_VBUS
NetCN7_2: CN7.2(DM) R67.1 U15.D1(D-in)
NetCN7_3: CN7.3(DP) R68.1 U15.C1(D+in)
NetCN7_4: CN7.4(ID) R64.2 U15.A3(ID)
NetLD6_1: LD6.1 R71.1
NetLD6_2: LD6.2 T10.3(C)
NetLD7_1: LD7.1 R73.1
NetLD7_2: LD7.2 R66.1 R72.1 U14.3(~{FAULT})
NetR61_2: R61.2 R62.1 U14.4(~{EN})
NetR63_1: R63.1 R65.1 T10.1(B)

Not connected (* = marked no-connect by the designer): U15 A2(Dz) B1(Pd1) B2(Pup) C2(Pd2)

### Notes on the sheet
- PC9
- PC10
- PC11
- PC12
- PA11
- PA12
- Title:
- Project:
- Size:
- Date:
- A4
- Reference:
- Sheet:
- Revision:
- of
- (in symbol USB-MICRO-AB) USB_Micro-AB receptacle

### Library data of the parts
C67 = Cap_4.7uF_POL_10%_TANA: Polarized Capacitor,4.7uF,16V,10%,typeA,AVX; Manuf_Part_1: TAJA475K016R; Revision: July-2002: Re-released for DXP Platform.; Value: 4.7uF; Manuf_1: AVX; Order: TAJA475K016R
CN7 = USB-MICRO-AB: USB-MICRO-AB, 47590-0001, SMT, MOLEX; Ref St: xxxxxxx; Manuf_1: MOLEX; Manuf_Part_1: 47590-0001; ECCN_US/EU: n/a; Distrib: *
LD6 = LED_green: LED, green, 0603; Manuf_1: everlight; Manuf_Part_1: 19-213SYGC/S530-E2/TR8; Description: LED,green,0603,19-213SYGC/S530-E2/TR8,everlight; ECCN_US/EU: EAR99/NEC; Order: 19-213SYGC/S530-E2/TR8
LD7 = LED_red: LED, red, 0603; Manuf_1: everlight; Manuf_Part_1: 19-213-R6C-AP1Q2B/3T; Description: LED,red,0603,19-213-R6C-AP1Q2B/3T,everlight; ECCN_US/EU: EAR99/NEC; Order: 19-213-R6C-AP1Q2B/3T
R61 R64 R66 = Res_0_5%_0402: as R1 on sheet ST_LINK_V2-1; ECCN_US/EU: n/a; Manuf_1: YAGEO; Distrib: FARNELL
R62 = Res_10K_1%_0402: as R10 on sheet ST_LINK_V2-1; Value: 10K; Manuf_1: YAGEO; Order: RC0402FR-0710KL; ECCN_US/EU: n/a
R63 = Res_NA_0402: Resistor,[NA],0402; Fitted: NO; Value: [NA]; ECCN_US/EU: n/a
R65 R72 = Res_47K_1%_0402: Resistor,47K,0402,1%,YAGEO; Manuf_Part_1: RC0402FR-0747KL; Order: 9239430; Value: 47K; Manuf_1: YAGEO; ECCN_US/EU: n/a; Distrib: FARNELL
R67 R68 = Res1: Resistor; Value: 1K; Published: 8-Jun-2000; Revision: July-2002: Re-released for DXP Platform.; Publisher: Altium Limited
R71 = Res_330_1%_0603: Resistor,330,0603,1%,YAGEO; Manuf_Part_1: RT0603FRE07330RL; Value: 330; Order: 1500622RL; ECCN_US/EU: n/a; Manuf_1: YAGEO; Distrib: FARNELL
R73 = Res_620_1%_0603: Resistor,620,0603,1%,VISHAY; Manuf_Part_1: CRCW0603620RFKEA; Manuf_1: VISHAY DRALORIC; Value: 620; Order: 2122341; ECCN_US/EU: n/a; Distrib: FARNELL
T10 = 9013-SOT23: NPN Bipolar Transistor; Manuf_1: NXP; Manuf_Part_1: BSR14; Description: NPN Bipolar Transistor, SOT-23 Footprint; Order: 1081310; ECCN_US/EU: EAR99/NEC; Revision: July-2002: Re-released for DXP Platform.; Distrib: FARNELL
U14 = STMPS2141STR: Enhanced single channel power switches; Manuf_1: STM; Provided: ST; ECCN_US/EU: EAR99/NEC; Ref St: 9159003; Order: STMPS2141STR; Manuf_Part_1: STMPS2141STR; Distrib: ST
U15 = EMIF02-USB03F2: 2-line IPAD, EMI filter including ESD protection; Manuf_1: STM; Provided: ST; ECCN_US/EU: EAR99/NEC; Ref St: 9179037; Order: EMIF02-USB03F2; Manuf_Part_1: EMIF02-USB03F2; Distrib: ST

## Sheet Peripherals.SchDoc: Joystick, ACP, LEDs and Push Button
size A4; Date: 01-DEC-2013; Author: A.B; CompanyName: STMicroelectronics; Organization: Microcontrollers Division; Address1: 12, Rue Jules HOROWITZ; Address2: 38019 Grenoble; Address3: FRANCE; DocumentNumber: MB1184; Revision: C-01; SheetNumber: 5; SheetTotal: 10; Project: STM32L476G-DISCO
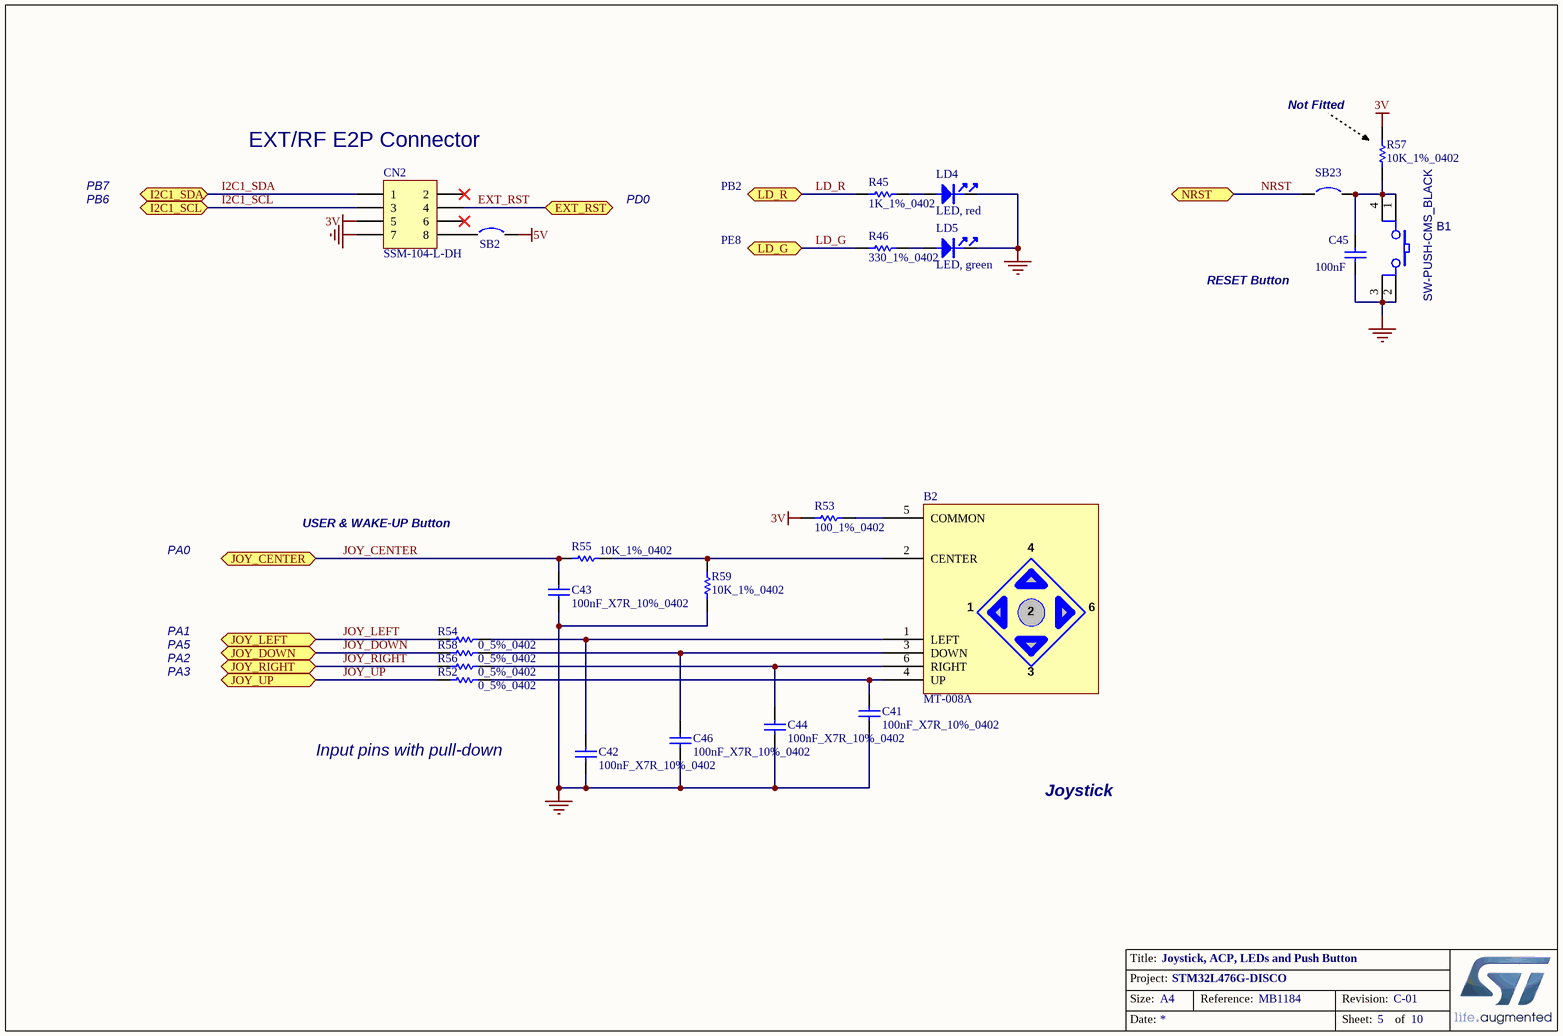
[diagram p3: Peripherals.SchDoc]

### Parts
B1  SW-PUSH-CMS_BLACK  [BP1CMS]
B2  MT-008A  [MT-008A]
C41  100nF_X7R_10%_0402  [0402C]
C42  100nF_X7R_10%_0402  [0402C]
C43  100nF_X7R_10%_0402  [0402C]
C44  100nF_X7R_10%_0402  [0402C]
C45  100nF  [0402C]
C46  100nF_X7R_10%_0402  [0402C]
CN2  SSM-104-L-DH  [SSM-104-L-DH]
LD4  LED, red  [0603D]
LD5  LED, green  [0603D]
R45  1K_1%_0402  [0402R]
R46  330_1%_0402  [0402R]
R52  0_5%_0402  [0402R]
R53  100_1%_0402  [0402R]
R54  0_5%_0402  [0402R]
R55  10K_1%_0402  [0402R]
R56  0_5%_0402  [0402R]
R57  10K_1%_0402  [0402R]
R58  0_5%_0402  [0402R]
R59  10K_1%_0402  [0402R]
SB2  Circuit Breaker  [JP2_SMD]  (value not drawn)
SB23  Circuit Breaker  [JP2_SMD]  (value not drawn)

### Ports
EXT_RST, I2C1_SCL, I2C1_SDA, JOY_CENTER, JOY_DOWN, JOY_LEFT, JOY_RIGHT, JOY_UP, LD_G, LD_R, NRST

### Nets
3V: CN2.5 R53.1 R57.2
5V: SB2.2
GND: B1.2 B1.3 C41.1 C42.1 C43.1 C44.1 C45.1 C46.1 CN2.7 LD4.2 LD5.2 R59.1
EXT_RST: CN2.4 ; port EXT_RST
I2C1_SCL: CN2.3 ; port I2C1_SCL
I2C1_SDA: CN2.1 ; port I2C1_SDA
JOY_CENTER: C43.2 R55.1 ; port JOY_CENTER
JOY_DOWN: R58.1 ; port JOY_DOWN
JOY_LEFT: R54.1 ; port JOY_LEFT
JOY_RIGHT: R56.1 ; port JOY_RIGHT
JOY_UP: R52.1 ; port JOY_UP
LD_G: R46.1 ; port LD_G
LD_R: R45.1 ; port LD_R
NRST: SB23.1 ; port NRST
NetB1_1: B1.1 B1.4 C45.2 R57.1 SB23.2
NetB2_1: B2.1(LEFT) C42.2 R54.2
NetB2_2: B2.2(CENTER) R55.2 R59.2
NetB2_3: B2.3(DOWN) C46.2 R58.2
NetB2_4: B2.4(UP) C41.2 R52.2
NetB2_5: B2.5(COMMON) R53.2
NetB2_6: B2.6(RIGHT) C44.2 R56.2
NetCN2_8: CN2.8 SB2.1
NetLD4_1: LD4.1 R45.2
NetLD5_1: LD5.1 R46.2

Not connected (* = marked no-connect by the designer): CN2 2* 6*

### Notes on the sheet
- (near R57) Not Fitted
- (near CN2) EXT/RF E2P Connector
- PB6
- PB7
- PD0
- PB2
- PE8
- RESET Button
- PA0
- USER & WAKE-UP Button
- PA1
- PA5
- PA2
- PA3
- Input pins with pull-down
- Joystick
- Title:
- Project:
- Size:
- Date:
- A4
- Reference:
- Sheet:
- Revision:
- of

### Library data of the parts
B1 = SW-PUSH-CMS_BLACK: Non-Open Push-Button 0.1A 24V; Manuf_2: FARNELL; Manuf_Part_2: 535-930; Manuf_1: wealthmetal; Manuf_Part_1: TD0341X-G01-BLA; Ref St: 9180120; Description: Non-Open Push Button,Black 0.1A 24V,Square head,6*6,SMT,180Degree,TD-0341X-GO1,wealthmetal; Distrib: JFVNY; ECCN_US/EU: n/a
B2 = MT-008A: Joystick with Hat, Multi Function Switch; Manuf_1: XIEJIA Electronics; Manuf_Part_1: MT-008A; Distrib: Jiubaba; Order: MT-008A; ECCN_US/EU: n/a
C41-C46 = Cap_100nF_X7R_10%_0402: as C2 on sheet ST_LINK_V2-1; Revision: July-2002: Re-released for DXP Platform.; Value: 100nF; Order: CC0402KRX7R7BB104; Manuf_1: YAGEO
  C41-C44 C46: ECCN_US/EU: n/a
CN2 = SSM-104-L-DH: Header, 5-Pin, Dual row; Revision: 17-Jul-2002: Re-released for DXP Platform.; Publisher: Altium Limited
LD4 = LED_red: as LD7 on sheet USB_OTG_FS; Order: 19-213-R6C-AP1Q2B/3T
LD5 = LED_green: as LD6 on sheet USB_OTG_FS; Order: 19-213SYGC/S530-E2/TR8
R45 = Res_1K_1%_0402: as R2 on sheet ST_LINK_V2-1; Value: 1K; Manuf_1: YAGEO; Order: RC0402FR-071KL; ECCN_US/EU: n/a
R46 = Res_330_1%_0402: as R4 on sheet ST_LINK_V2-1; ECCN_US/EU: n/a; Manuf_1: YAGEO; Distrib: DIGIKEY; Order: RC0402FR-07330RL
R52 R54 R56 R58 = Res_0_5%_0402: as R1 on sheet ST_LINK_V2-1; ECCN_US/EU: n/a; Manuf_1: YAGEO; Distrib: FARNELL
R53 = Res_100_1%_0402: as R79 on sheet ST_LINK_V2-1; Manuf_1: YAGEO; ECCN_US/EU: n/a; Distrib: FARNELL
R55 R59 = Res_10K_1%_0402: as R10 on sheet ST_LINK_V2-1; Value: 10K; Manuf_1: YAGEO; Order: RC0402FR-0710KL; ECCN_US/EU: n/a
R57 = Res_10K_1%_0402: Resistor,10K,0402,1%,YAGEO; Manuf_Part_1: RC0402FR-0710KL; Fitted: NO; Value: 10K; Manuf_1: YAGEO; Order: RC0402FR-0710KL; ECCN_US/EU: n/a
SB2 = Circuit Breaker: Solder: NO; Revision: July-2002: Re-released for DXP Platform.
SB23 = Circuit Breaker: Solder: YES; Revision: July-2002: Re-released for DXP Platform.

## Sheet QSPI.SchDoc: Quad SPI Flash Memory
size A4; Date: 01-DEC-2013; Author: A.B; CompanyName: STMicroelectronics; Organization: Microcontrollers Division; Address1: 12, Rue Jules HOROWITZ; Address2: 38019 Grenoble; Address3: FRANCE; DocumentNumber: MB1184; Revision: C-01; SheetNumber: 9; SheetTotal: 10; Project: STM32L476G-DISCO
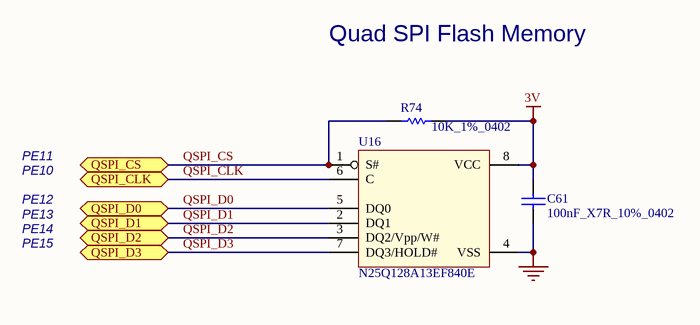
[diagram p4: QSPI.SchDoc]

### Parts
C61  100nF_X7R_10%_0402  [0402C]
R74  10K_1%_0402  [0402R]
U16  N25Q128A13EF840E  [V-PDFN-8 8x6]

### Ports
QSPI_CLK, QSPI_CS, QSPI_D0, QSPI_D1, QSPI_D2 (bidir), QSPI_D3

### Nets
3V: C61.2 R74.2 U16.8(VCC)
GND: C61.1 U16.4(VSS)
QSPI_CLK: U16.6(C) ; port QSPI_CLK
QSPI_CS: R74.1 U16.1(S#) ; port QSPI_CS
QSPI_D0: U16.5(DQ0) ; port QSPI_D0
QSPI_D1: U16.2(DQ1) ; port QSPI_D1
QSPI_D2: U16.3(DQ2/Vpp/W#) ; port QSPI_D2
QSPI_D3: U16.7(DQ3/HOLD#) ; port QSPI_D3

### Notes on the sheet
- Quad SPI Flash Memory
- PE10
- PE11
- PE12
- PE13
- PE14
- PE15
- Title:
- Project:
- Size:
- Date:
- A4
- Reference:
- Sheet:
- Revision:
- of

### Library data of the parts
C61 = Cap_100nF_X7R_10%_0402: as C2 on sheet ST_LINK_V2-1; Revision: July-2002: Re-released for DXP Platform.; Value: 100nF; Order: CC0402KRX7R7BB104; Manuf_1: YAGEO; ECCN_US/EU: n/a
R74 = Res_10K_1%_0402: as R10 on sheet ST_LINK_V2-1; Value: 10K; Manuf_1: YAGEO; Order: RC0402FR-0710KL; ECCN_US/EU: n/a
U16 = N25Q128A13EF840E: 128Mb, 3V, Multiple I/O Serial Flash Memory, Quad/Dual; Manuf_1: MICRON; Manuf_Part_2: N25Q256A13EF840E; Manuf_Part_3: N25Q512A13EF840E; ECCN_US/EU: 3A991/NEC; Order: N25Q128A13EF840F-ND; Manuf_Part_1: N25Q128A13EF840E; Distrib: DIGIKEY

## Nets that join several sheets
2V5: MB1184 (P1.3), ST_LINK_V2-1 (C47.1 C48.2 U12.5)
3V: MB1184 (P1.5), ST_LINK_V2-1 (D6.2), Peripherals (CN2.5 R53.1 R57.2), QSPI (C61.2 R74.2 U16.8)
3V3: MB1184 (P1.1), ST_LINK_V2-1 (D6.1 JP6.2 SB28.1)
3V3_REG: ST_LINK_V2-1 (6 pins), USB_OTG_FS (R62.2 R71.2 R72.2 R73.2)
5V: MB1184 (P2.5), ST_LINK_V2-1 (9 pins), USB_OTG_FS (U14.5), Peripherals (SB2.2)
5V_IN: MB1184 (P2.3), ST_LINK_V2-1 (D3.1 D4.1)
5V_USB_ST_LINK: MB1184 (P2.1), ST_LINK_V2-1 (CN1.1 D2.1 R10.2)
GND: MB1184 (13 pins), ST_LINK_V2-1 (51 pins), USB_OTG_FS (7 pins), Peripherals (12 pins), QSPI (C61.1 U16.4)
3V3_REG-ON: MB1184 (P1.7), ST_LINK_V2-1 (R33.2)
EXT_RST: MB1184 (P1.17), Peripherals (CN2.4)
I2C1_SCL: MB1184 (P1.15), Peripherals (CN2.3)
I2C1_SDA: MB1184 (P1.16), Peripherals (CN2.1)
JOY_CENTER: MB1184 (P1.10), Peripherals (C43.2 R55.1)
JOY_DOWN: MB1184 (P1.11), Peripherals (R58.1)
JOY_LEFT: MB1184 (P1.12), Peripherals (R54.1)
JOY_RIGHT: MB1184 (P1.13), Peripherals (R56.1)
JOY_UP: MB1184 (P1.14), Peripherals (R52.1)
LD_G: MB1184 (P1.9), Peripherals (R46.1)
LD_R: MB1184 (P1.8), Peripherals (R45.1)
NRST: MB1184 (P2.11), ST_LINK_V2-1 (JP3.2), Peripherals (SB23.1)
OTG_FS_VBUS: MB1184 (P2.4), USB_OTG_FS (5 pins)
QSPI_CLK: MB1184 (P2.14), QSPI (U16.6)
QSPI_CS: MB1184 (P2.13), QSPI (R74.1 U16.1)
QSPI_D0: MB1184 (P2.15), QSPI (U16.5)
QSPI_D1: MB1184 (P2.16), QSPI (U16.2)
QSPI_D2: MB1184 (P2.17), QSPI (U16.3)
QSPI_D3: MB1184 (P2.18), QSPI (U16.7)